# Altium schematic sheet Reset.SchDoc
size A4; SheetNumber: 6; SheetTotal: 8
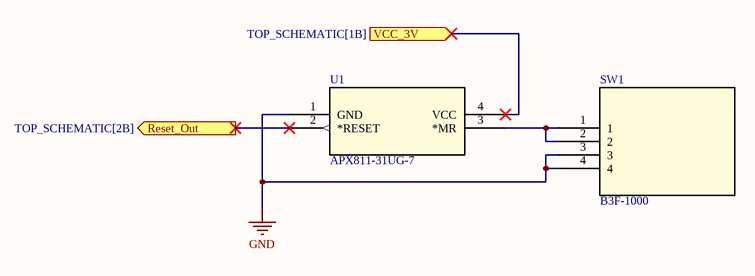
[diagram p0: Reset.SchDoc]

## Parts
SW1  B3F-1000  [SW_B3F-1000_OMR]
U1  APX811-31UG-7  [APX811-31UG-7_DIO]

## Ports
Reset_Out (out, see TOP_SCHEMATIC[2B]), VCC_3V (in, see TOP_SCHEMATIC[1B])

## Nets
GND: SW1.3 SW1.4 U1.1(GND)
Reset_Out: U1.2(*RESET) ; port Reset_Out
VCC_3V: U1.4(VCC) ; port VCC_3V
NetSW1_1: SW1.1 SW1.2 U1.3(*MR)

## Library data of the parts
SW1 = B3F-1000: Description; Manufacturer_Name: Omron; Copyright: Copyright (C) 2026 Ultra Librarian. All rights reserved.; Manufacturer_Part_Number: B3F-1000; RefDes: RefDes; Type: Type
U1 = APX811-31UG-7: No Description Available; Manufacturer_Name: Diodes Inc; Copyright: Copyright (C) 2026 Ultra Librarian. All rights reserved.; Manufacturer_Part_Number: APX811-31UG-7; RefDes: RefDes; Type: Type